# EasyEDA schematic encoder_立创EDA.json
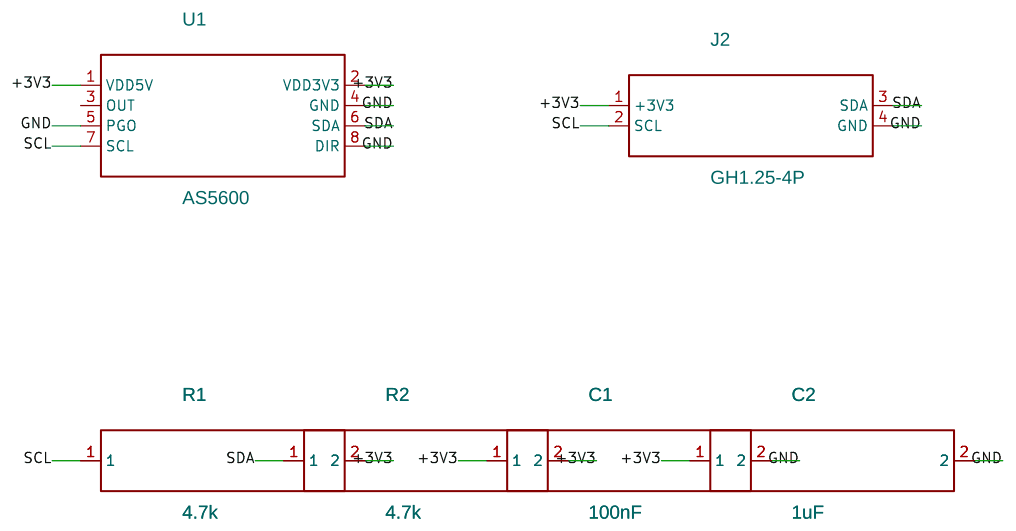
[diagram p0: schematic sheet]

## Parts
C1  100nF  [C0805]
C2  1uF  [C0805]
J2  GH1.25-4P  [GH1.25_4P]
R1  4.7k  [R0805]
R2  4.7k  [R0805]
U1  AS5600  [SOIC-8_L5.0-W4.0-P1.27-LS6.0-BL]

## Library data of the parts
C1 C2 J2 R1 R2 U1 = -: : Contributor; LCEDA_Lib: spicePre; U: spiceSymbolName

## Nets
+3V3: C1.1 C2.1 J2.1(+3V3) R1.2 R2.2 U1.1(VDD5V) U1.2(VDD3V3)
GND: C1.2 C2.2 J2.4(GND) U1.4(GND) U1.5(PGO) U1.8(DIR)
SCL: J2.2(SCL) R1.1 U1.7(SCL)
SDA: J2.3(SDA) R2.1 U1.6(SDA)

Not connected (* = marked no-connect by the designer): U1 3(OUT)
